# EAGLE design I2C-controller-board (EAGLE 6.5.0)
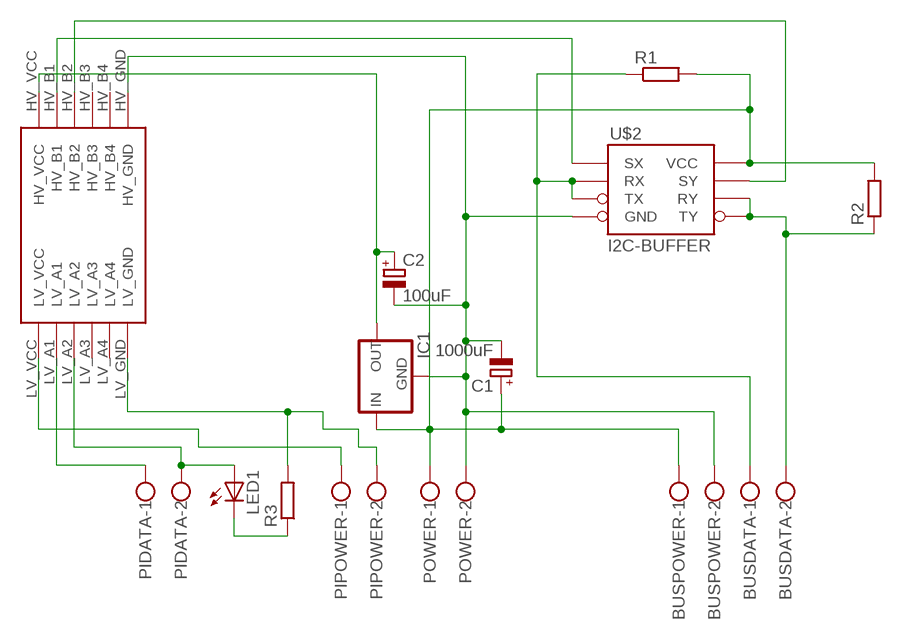
[diagram p0: schematic, sheet 1]

## Parts
BUSDATA  W237-102  [W237-102]
BUSPOWER  W237-102  [W237-102]
C1  1000uF  CPOL-EUE5-10.5  [E5-10,5]
C2  100uF  CPOL-EUE2.5-6  [E2,5-6]
IC1  78XXL  [78XXL]
LED1  LED5MM  [LED5MM]
PIDATA  W237-102  [W237-102]
PIPOWER  W237-102  [W237-102]
POWER  W237-102  [W237-102]
R1  R-EU_0204/7  [0204/7]
R2  R-EU_0204/7  [0204/7]
R3  R-EU_0204/7  [0204/7]
U$2  I2C-BUFFER  [I2C-BUFFER]
U$3  SPARKFUN_LEVEL_SHIFTER  [SPARKFUN_LEVEL_SHIFTER]

## Nets
N$1: PIDATA.1 U$3.LV_A1
N$2: U$2.1(SX) U$3.HV_B1
N$3: PIPOWER.1 U$3.LV_VCC
N$4: U$2.7(SY) U$3.HV_B2
N$5: LED1.K(C) R3.1
N$6: BUSPOWER.1 C1.+ IC1.IN POWER.1 R1.2 R2.2 U$2.8(VCC)
N$7: BUSPOWER.2 C1.- C2.- IC1.GND POWER.2 U$2.4(GND) U$3.HV_GND
N$8: C2.+ IC1.OUT U$3.HV_VCC
N$9: LED1.A PIDATA.2 U$3.LV_A2
N$10: PIPOWER.2 R3.2 U$3.LV_GND
N$11: BUSDATA.2 R2.1 U$2.5(TY) U$2.6(RY)
N$12: BUSDATA.1 R1.1 U$2.2(RX) U$2.3(TX)
Unconnected: U$3.HV_B3 U$3.HV_B4 U$3.LV_A3 U$3.LV_A4

## Library data of the parts
BUSDATA BUSPOWER PIDATA PIPOWER POWER = con-wago-500:W237-102: WAGO SCREW CLAMP; MPN: 237-102; OC_FARNELL: unknown; OC_NEWARK: 70K9898
C1 C2 = rcl:CPOL-EU: POLARIZED CAPACITOR, European symbol
IC1 = v-reg:78XXL: VOLTAGE REGULATOR
LED1 = led:LED: LED OSRAM: - CHIPLED LG R971, LG N971, LY N971, LG Q971, LY Q971, LO R971, LY R971 LH N974, LH R974 LS Q976, LO Q976, LY Q976 LO Q996 - Hyper CHIPLED LW Q18S LB Q993, LB Q99A, LB R99A - SideLED LS A670, LO A670, LY A670, LG A670, LP A670 LB A673, LV A673, LT A673, LW A673 LH A674 LY A675 LS A676, LA A676, LO A676, LY A676, LW A676 LS A679, LY A679, LG A679 - Hyper Micro SIDELED® LS Y876, LA Y876, LO Y876, LY Y876 LT Y87S - SmartLED LW L88C, LW L88S LB L89C, LB L89S, LG L890 LS L89K, LO L89K, LY L89K LS L896, LA L896, LO L896, LY L896 - TOPLED LS T670, LO T670, LY T670, LG T670, LP T670 LSG T670, LSP T670, LSY T670, LOP T670, LYG T670 LG T671, LOG T671, LSG T671 LB T673, LV T673, LT T673, LW T673 LH T674 LS T676, LA T676, LO T676, LY T676, LB T676, LH T676, LSB T676, LW T676 LB T67C, LV T67C, LT T67C, LS T67K, LO T67K, LY T67K, LW E67C LS E67B, LA E67B, LO E67B, LY E67B, LB E67C, LV E67C, LT E67C LW T67C LS T679, LY T679, LG T679 LS T770, LO T770, LY T770, LG T770, LP T770 LB T773, LV T773, LT T773, LW T773 LH T774 LS E675, LA E675, LY E675, LS T675 LS T776, LA T776, LO T776, LY T776, LB T776 LHGB T686 LT T68C, LB T68C - Hyper Mini TOPLED® LB M676 - Mini TOPLED Santana® LG M470 LS M47K, LO M47K, LY M47K Source: http://www.osram.convergy.de LUXEON: - LUMILED® LXK2-PW12-R00, LXK2-PW12-S00, LXK2-PW14-U00, LXK2-PW14-V00 LXK2-PM12-R00, LXK2-PM12-S00, LXK2-PM14-U00 LXK2-PE12-Q00, LXK2-PE12-R00, LXK2-PE12-S00, LXK2-PE14-T00, LXK2-PE14-U00 LXK2-PB12-K00, LXK2-PB12-L00, LXK2-PB12-M00, LXK2-PB14-N00, LXK2-PB14-P00, LXK2-PB14-Q00 LXK2-PR12-L00, LXK2-PR12-M00, LXK2-PR14-Q00, LXK2-PR14-R00 LXK2-PD12-Q00, LXK2-PD12-R00, LXK2-PD12-S00 LXK2-PH12-R00, LXK2-PH12-S00 LXK2-PL12-P00, LXK2-PL12-Q00, LXK2-PL12-R00 Source: www.luxeon.com KINGBRIGHT: KA-3528ASYC Source: www.kingbright.com
R1-R3 = resistor:R-EU_: RESISTOR, European symbol
U$2 = Custom_I2C_buffer:I2C-BUFFER
U$3 = Custom:SPARKFUN_LEVEL_SHIFTER

## Board
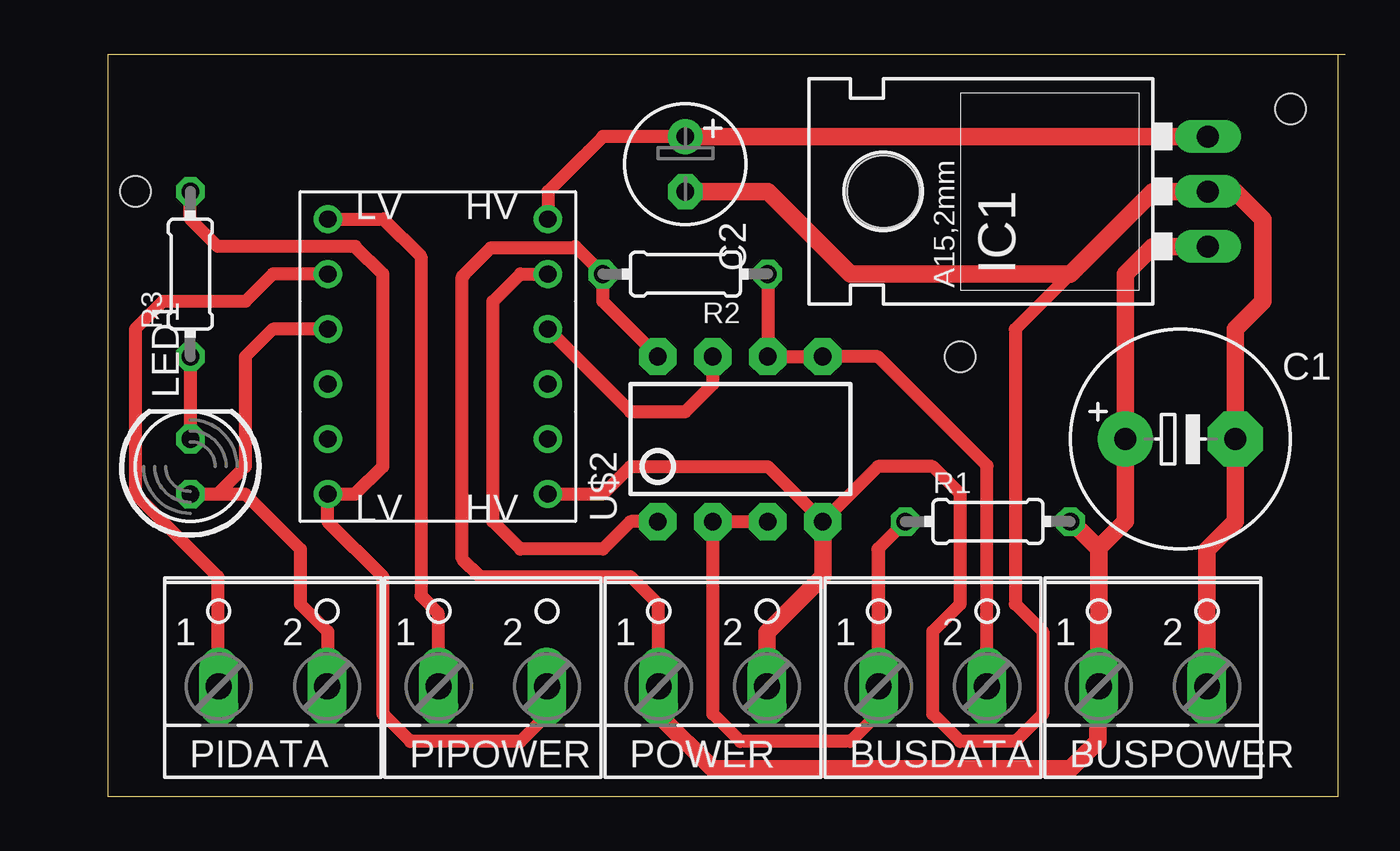
[diagram p1: board, top side]
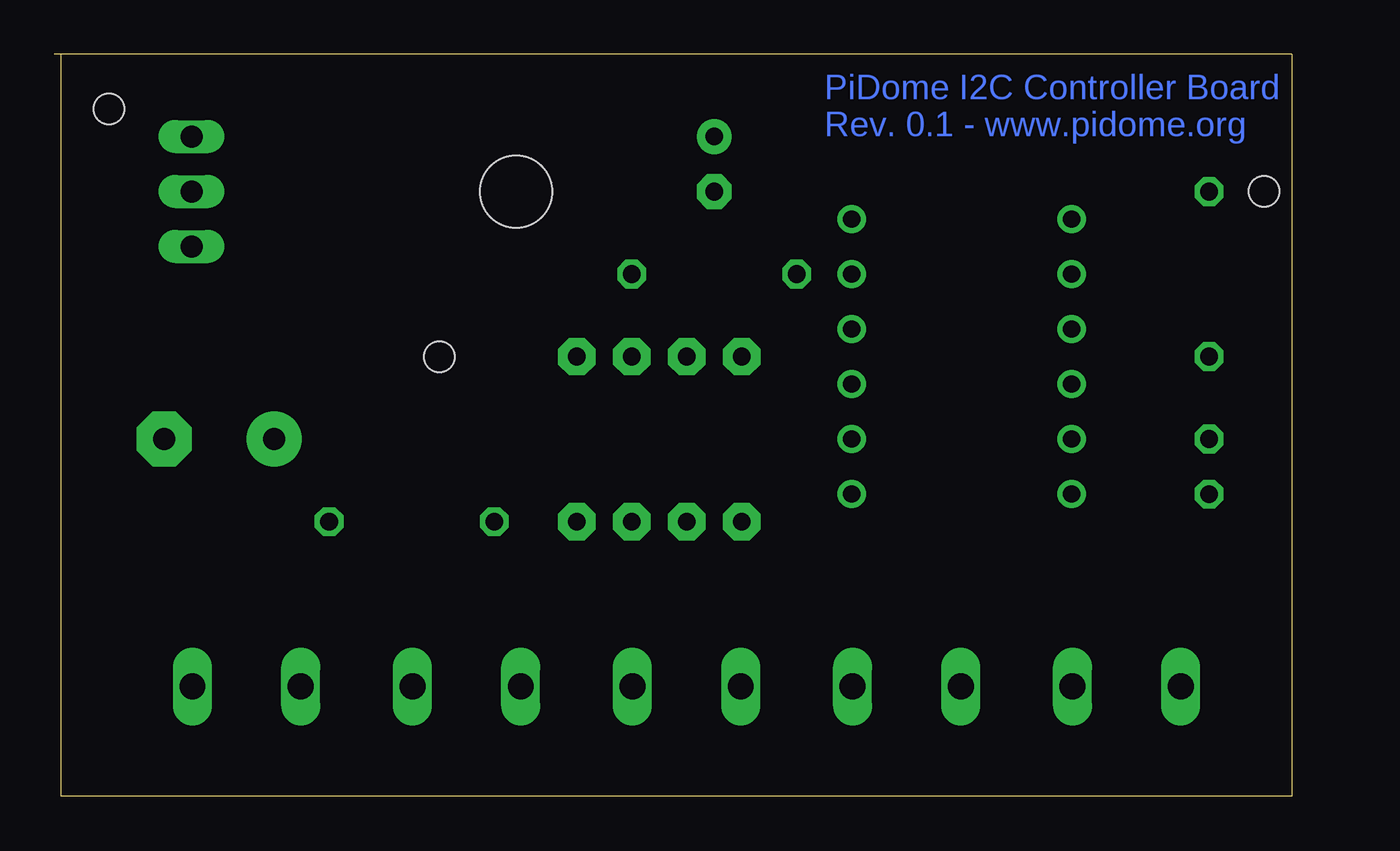
[diagram p2: board, bottom side, seen from below]

Size 57.15 x 34.29 mm. Coordinates in mm from the lower left corner, seen from the top.
Outline: 56.82,34.28 56.82,0 0,0 0,34.28 57.15,34.29
Copper layers (1*16): Top 0.035mm / dielectric 1.5mm / Bottom 0.035mm
Design rules "default": minimum track width 10mil, minimum drill 24mil, track to track 8mil, track to pad 8mil, pad to pad 8mil, via to via 8mil, smd to smd 8mil, copper to edge 40mil, drill to drill 8mil, minimum pad ring 10mil, minimum via ring 8mil, stop-mask expansion 4mil, vias tented up to drill 0mil, thermal gap 10mil
Holes 1.4 mm at 1.27,27.94 54.61,31.75 39.37,20.32

### Footprints (pad centres in the part's own frame; a part is rotated, then mirrored left to right if it is on the bottom)
W237-102 = drill 1.194 long: 1 -2.5,-1.27; 2 2.5,-1.27
E5-10,5 = drill 1.016 pad 2.54: + -2.54,0 | drill 1.016 pad 2.54 octagon: - 2.54,0
E2,5-6 = drill 0.813 pad 1.6: + -1.27,0 | drill 0.813 pad 1.6 octagon: - 1.27,0
78XXL = drill 1.016 long: GND 0,-3.81; IN -2.54,-3.81; OUT 2.54,-3.81 | hole 3.302: 0,11.176
LED5MM = drill 0.813 octagon: A -1.27,0; K 1.27,0
0204/7 = drill 0.813 octagon: 1 -3.81,0; 2 3.81,0
I2C-BUFFER = drill 0.813 pad 1.727 octagon: 1 -2.54,-3.81; 2 0,-3.81; 3 2.54,-3.81; 4 5.08,-3.81; 5 5.08,3.81; 6 2.54,3.81; 7 0,3.81; 8 -2.54,3.81
SPARKFUN_LEVEL_SHIFTER = drill 0.8: HV_B1 5.08,3.81; HV_B2 5.08,1.27; HV_B3 5.08,-1.27; HV_B4 5.08,-3.81; HV_GND 5.08,-6.35; HV_VCC 5.08,6.35; LV_A1 -5.08,3.81; LV_A2 -5.08,1.27; LV_A3 -5.08,-1.27; LV_A4 -5.08,-3.81; LV_GND -5.08,-6.35; LV_VCC -5.08,6.35

### Placement (x,y rotation side)
BUSDATA  38.1,6.35 0 top
BUSPOWER  48.26,6.35 0 top
C1  49.53,16.51 0 top
C2  26.67,29.21 270 top
IC1  46.99,27.94 90 top
LED1  3.81,15.24 90 top
PIDATA  7.62,6.35 0 top
PIPOWER  17.78,6.35 0 top
POWER  27.94,6.35 0 top
R1  40.64,12.7 0 top
R2  26.67,24.13 180 top
R3  3.81,24.13 90 top
U$2  27.94,16.51 0 top
U$3  15.24,20.32 0 top

### Tracks (layer width: path | path; a pad name or v marks a point on that pad's centre or on a via)
N$1
  Top 0.61: U$3.LV_A1 7.62,24.13 6.35,22.86 2.54,22.86 1.27,21.59 1.27,13.97 5.08,10.16 5.08,5.12 PIDATA.1
N$2
  Top 0.61: U$2.1 24.13,12.7 22.86,11.43 19.05,11.43 17.78,12.7 17.78,22.86 19.05,24.13 U$3.HV_B1
N$3
  Top 0.61: U$3.LV_VCC 12.72,26.67 14.46,24.93 14.46,9.28 15.25,8.49 15.25,5.11 PIPOWER.1
N$4
  Top 0.61: U$3.HV_B2 24.13,17.78 26.67,17.78 27.94,19.05 U$2.7
N$5
  Top 0.61: R3.1 LED1.K
N$6
  Top 0.61: U$2.8 22.86,22.86 R2.2 21.59,25.4 21.53,25.34 17.7,25.34 16.45,24.1 16.37,24.02 16.37,10.98 17.19,10.16 24.13,10.16 25.4,8.89 25.4,5.12 POWER.1
  Top 0.813: 45.76,11.43 BUSPOWER.1 45.72,5.04 45.72,2.54 44.45,1.27 27.94,1.27 25.44,3.77 POWER.1 | 45.76,11.43 45.76,11.47 46.99,12.7 C1.+ 46.99,24.13 48.26,25.4 IC1.IN | R1.2 44.49,12.7 45.76,11.43
N$7
  Top 0.61: U$3.HV_GND 22.86,13.97 24.13,15.24 30.48,15.24 U$2.4 35.56,15.24 38.1,15.24 39.37,13.97 39.37,8.89 38.1,7.62 38.1,3.81 39.37,2.54 41.91,2.54 43.18,3.81 43.18,7.62 41.91,8.89 41.91,21.59 48.26,27.94
  Top 0.813: BUSPOWER.2 50.76,11.39 52.07,12.7 C1.- 52.07,21.59 53.34,22.86 53.34,26.67 52.07,27.94 IC1.GND 48.26,27.94 44.45,24.13 34.29,24.13 30.48,27.94 C2.- | POWER.2 30.44,7.58 33.02,10.16 U$2.4
N$8
  Top 0.61: C2.+ 22.86,30.48 20.32,27.94 U$3.HV_VCC
  Top 0.813: IC1.OUT C2.+
N$9
  Top 0.61: LED1.A 5.08,13.97 | 5.08,13.97 6.35,13.97 8.89,11.43 8.89,8.89 10.16,7.62 10.16,5.12 PIDATA.2 | U$3.LV_A2 7.62,21.59 6.35,20.32 6.35,15.24 5.08,13.97
N$10
  Top 0.61: PIPOWER.2 20.28,3.77 19.05,2.54 13.97,2.54 12.7,3.81 12.7,10.16 10.16,12.7 U$3.LV_GND 11.43,13.97 12.7,15.24 12.7,24.13 11.43,25.4 5.08,25.4 3.81,26.67 R3.2
N$11
  Top 0.61: R2.1 U$2.6 U$2.5 35.56,20.32 40.6,15.28 BUSDATA.2
N$12
  Top 0.61: U$2.3 U$2.2 27.94,3.81 29.21,2.54 34.29,2.54 35.56,3.81 35.56,11.43 R1.1 35.6,11.47 BUSDATA.1

### Text on the board
Bottom: PiDome I2C Controller Board / Rev. 0.1 - www.pidome.org